# Altium schematic sheet PATHOS_PowerSupply.SchDoc: Motor/Drive Power Supply
size A4; Author: A. Kalberer; CompanyName: NTB; Organization: NTB Interstate University of Applied; Address1: Werdenbergstrasse 4; Address3: 9471 Buchs; Address4: Switzerland; DocumentNumber: 2; Revision: 0.1; SheetNumber: 2; SheetTotal: 5; Organization1: Sciences of Technology Buchs; Size: A4
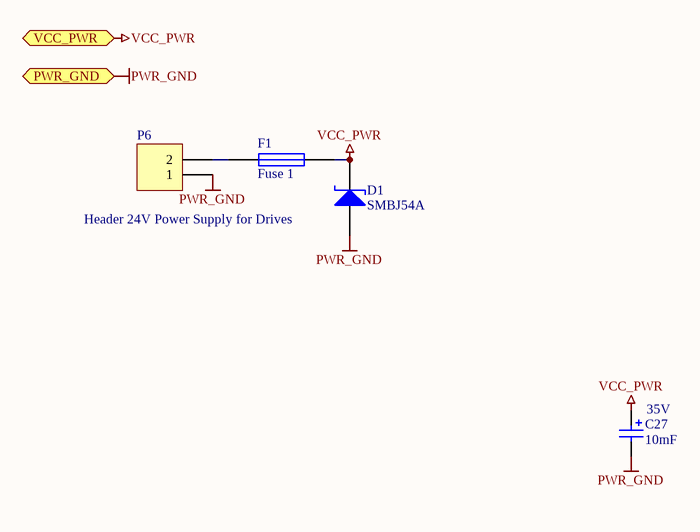
[diagram p0: PATHOS_PowerSupply.SchDoc]

## Parts
C27  Voltage Maxium: 35V  [Cap_SLP_C7_10mF]  (hidden comment: 10mF)
D1  SMBJ54A  [TVS_DO214AA]
F1  Fuse 1  [Fuse40ASMD]
P6  Header 24V Power Supply for Drives  [PhoenixHeader5_08_Vertical_unsymetric]

## Ports
PWR_GND, VCC_PWR

## Nets
PWR_GND: C27.2(Neg) D1.A P6.1 ; port PWR_GND
VCC_PWR: C27.1(Pos) D1.K F1.2 ; port VCC_PWR
NetF1_1: F1.1 P6.2

## Notes on the sheet
- Title:
- Description:
- Size:
- Date:
- Name:
- Number:
- Time:
- Revision:
- Sheet
- Checked:
- of
- File:

## Library data of the parts
C27 = C_POL: Polarized Capacitor Positive Mark Bar; #Manufacturer: Generic Components; #Publisher: Dr. A. Heinzelmann; #Class: Passive; Initial Voltage: 0V; #Published: 2006-10-07; #ClassSub: Capacitor; Type: *; Value: 10mF
D1 = Diode SMBJ54A: TVS Diode; Published: 8-Jun-2000; PackageVersion: Feb-1998; PackageReference: TO-220AC; Publisher: Altium Limited; PackageDescription: TO, Thru-Hole, Vertical, Heatsink Mounted; 3 In-Line Leads (1 Absent); Pitch 2.54 mm
F1 = Fuse 1: Fuse; Published: 8-Jun-2000; LatestRevisionDate: 17-Jul-2002; LatestRevisionNote: Re-released for DXP Platform.; PackageReference: PIN-W2/E2.8; Publisher: Altium Limited; PackageDescription: Thru-Hole; 2 Leads
P6 = Header 2: Header, 2-Pin; LatestRevisionDate: 17-Jul-2002; LatestRevisionNote: Re-released for DXP Platform.; Publisher: Altium Limited